# Altium schematic sheet Inertial_Measurement_RTC.SchDoc
size A3; Organization: Altium Limited; Address1: L3, 12a Rodborough Rd; Address2: Frenchs Forest; Address3: NSW; Address4: Australia 2086; DocumentNumber: 1; SheetNumber: 1; SheetTotal: 8
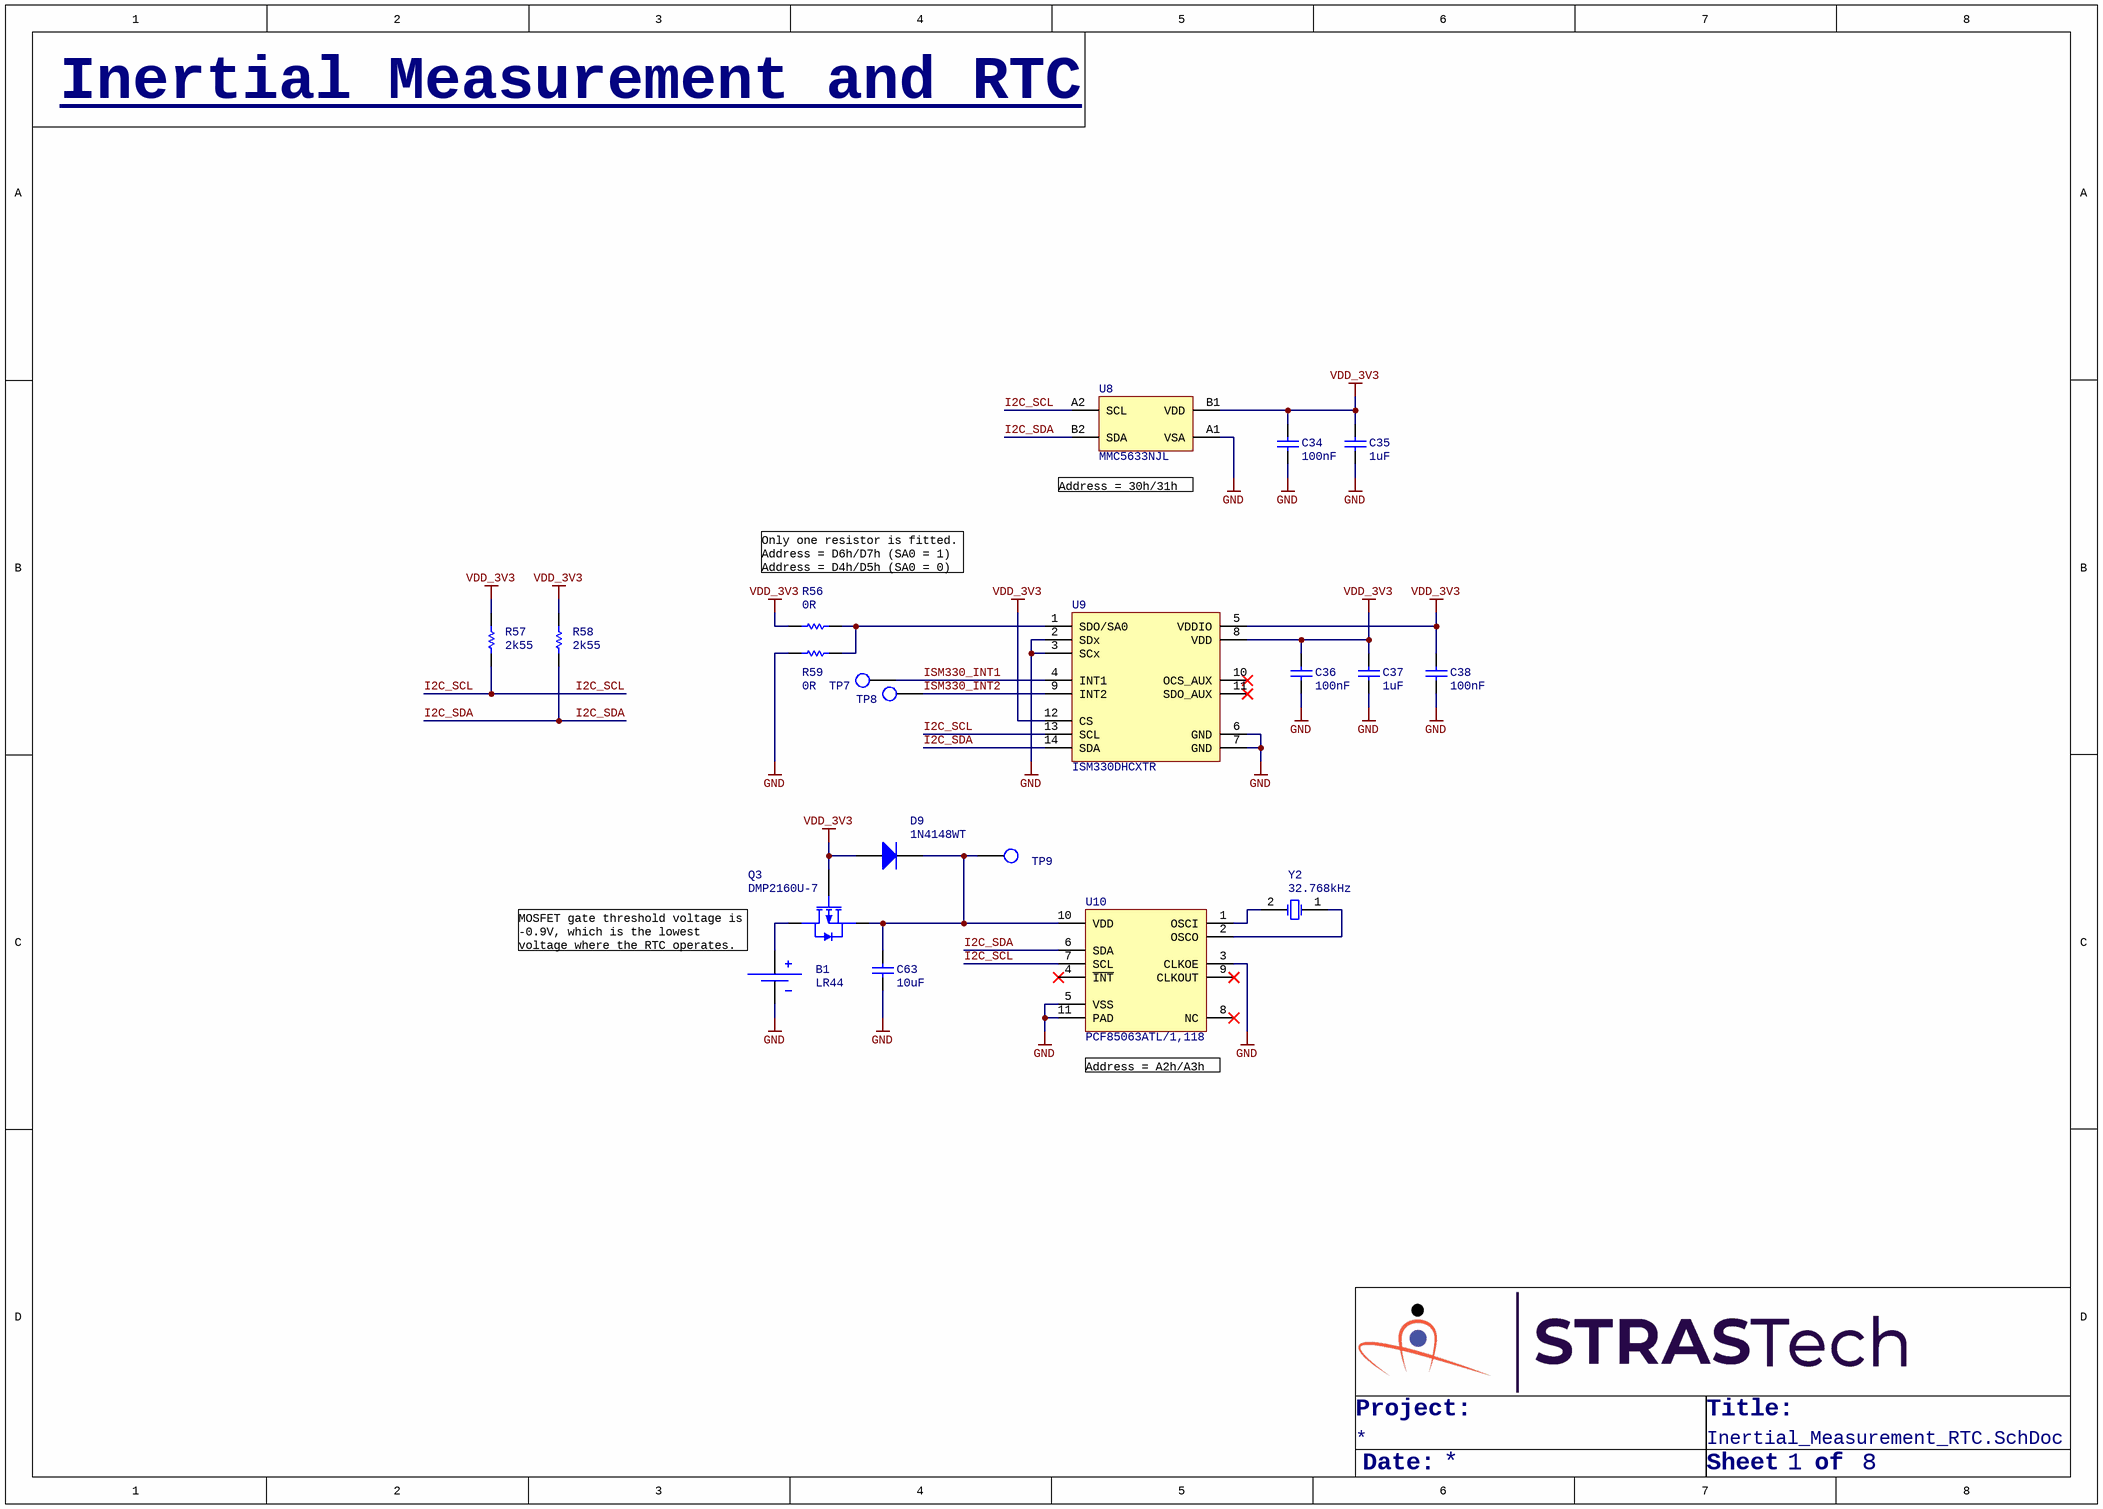
[diagram p0: Inertial_Measurement_RTC.SchDoc]

## Parts
B1  LR44  [Holder,Cell,LR44,PCB,Thru]
C34  100nF  [Cap,SMD,0402]
C35  1uF  [Cap,SMD,0402]
C36  100nF  [Cap,SMD,0402]
C37  1uF  [Cap,SMD,0402]
C38  100nF  [Cap,SMD,0402]
C63  10uF  [Cap,SMD,0402]
D9  1N4148WT  [SOD523]
Q3  DMP2160U-7  [SOT23-3]
R56  0R  [RES,0402]
R57  2k55  [RES,0402]
R58  2k55  [RES,0402]
R59  0R  [RES,0402]
TP7  TESTPOINT  [testpoint,smd,round,1mm]  (value not drawn)
TP8  TESTPOINT  [testpoint,smd,round,1mm]  (value not drawn)
TP9  TESTPOINT  [testpoint,smd,round,1mm]  (value not drawn)
U8  MMC5633NJL  [IC,WLP,2x2,P0.4mm]
U9  ISM330DHCXTR  [IC,LGA-14L,2.5x3mm]
U10  PCF85063ATL/1,118  [IC,DFN-10_3x3,P0.5mm]
Y2  32.768kHz  [XTAL,SMD,2PIN,2.0x1.2MM]

## Nets
GND: B1.2(BATT_N) C34.2 C35.1 C36.1 C37.1 C38.1 C63.2 R59.1 U8.A1(VSA) U9.2(SDx) U9.3(SCx) U9.6(GND) U9.7(GND) U10.3(CLKOE) U10.5(VSS) U10.11(PAD)
VDD_3V3: C34.1 C35.2 C36.2 C37.2 C38.2 D9.2(A) Q3.1(G) R56.1 R57.2 R58.2 U8.B1(VDD) U9.5(VDDIO) U9.8(VDD) U9.12(CS)
I2C_SCL: R57.1 U8.A2(SCL) U9.13(SCL) U10.7(SCL)
I2C_SDA: R58.1 U8.B2(SDA) U9.14(SDA) U10.6(SDA)
ISM330_INT1: TP7.1(TP) U9.4(INT1)
ISM330_INT2: TP8.1(TP) U9.9(INT2)
NetB1_1: B1.1(BATT_P) Q3.3(D)
NetC63_1: C63.1 D9.1(K) Q3.2(S) TP9.1(TP) U10.10(VDD)
NetR56_2: R56.2 R59.2 U9.1(SDO/SA0)
NetU10_1: U10.1(OSCI) Y2.2(GND)
NetU10_2: U10.2(OSCO) Y2.1(OSC1)

Not connected (* = marked no-connect by the designer): U9 10(OCS_AUX)* 11(SDO_AUX)*; U10 4(~{INT})* 8(NC)* 9(CLKOUT)*

## Notes on the sheet
- Inertial Measurement and RTC
- (near U8) Address = 30h/31h
- Only one resistor is fitted.
  Address = D6h/D7h (SA0 = 1)
  Address = D4h/D5h (SA0 = 0)
- MOSFET gate threshold voltage is -0.9V, which is the lowest voltage where the RTC operates.
- (near U10) Address = A2h/A3h
- Project:
- Title:
- Date:
- Sheet
- of
- Title
- Size:
- A3
- Revision:
- Design By:

## Library data of the parts
B1 = Holder,Cell,LR44,PCB,Thru: Battery Retainer Coin, 11.6mm 1 Cell PC Pin; Manufacturer: Keystone Electronics; Manufacturer Part Number: 2997; Vendor Part Number: 36-2997-ND; Vendor: Digikey; CreatedBy: Judd Foster; HelpURL: https://www.keyelco.com/userAssets/file/M65p7.pdf
C34 C36 C38 = CAP,Cer,100nF,25VDC,X7R,0402: 0.1µF ±10% 25V Ceramic Capacitor X7R 0402 (1005 Metric); Vendor Part Number: 490-14603-1-ND; Manufacturer: Murata Electronics; Manufacturer Part Number: GRM155R71E104KE14J; Vendor: Digikey; HelpURL: https://search.murata.co.jp/Ceramy/image/img/A01X/G101/ENG/GRM155R71E104KE14-01.pdf; CreatedBy: Judd Foster
C35 C37 = CAP,Cer,1uF,35VDC,X5R,0402: 1 µF ±10% 35V Ceramic Capacitor X5R 0402 (1005 Metric); Vendor Part Number: 445-9073-1-ND; Manufacturer: TDK Corporation; Manufacturer Part Number: C1005X5R1V105K050BC; Vendor: Digikey; HelpURL: https://product.tdk.com/info/en/catalog/datasheets/mlcc_commercial_general_en.pdf?ref_disty=digikey; CreatedBy: Judd Foster
C63 = CAP,Cer,10uF,10VDC,X5R,0402: 10 µF ±20% 10V Ceramic Capacitor X5R 0402 (1005 Metric); Vendor Part Number: 1276-1450-1-ND; Manufacturer: Samsung Electro-Mechanics; Manufacturer Part Number: CL05A106MP5NUNC; Vendor: Digikey; HelpURL: https://media.digikey.com/pdf/Data%20Sheets/Samsung%20PDFs/CL05A106MP5NUNC_Spec.pdf; CreatedBy: Judd Foster
D9 = DIODE,Gen,75V,200mA,SOD523F: Diode Standard 75 V 200mA Surface Mount SOD-523F; Manufacturer: ON Semiconductor; Vendor Part Number: 1N4148WTCT-ND; Vendor: Digikey; CreatedBy: Judd Foster; HelpURL: https://rocelec.widen.net/view/pdf/bnxdzepaue/ONSM-S-A0003584797-1.pdf?t.download=true&u=5oefqw; Manufacturer Part Number: 1N4148WT
Q3 = MOSFET,P Ch,20V,3.2A: P-Channel 20 V 3.2A (Ta) 1.4W (Ta) Surface Mount SOT-23-3; Manufacturer: Diodes Incorporated; Vendor Part Number: DMP2160UDICT-ND; Vendor: Digikey; CreatedBy: Judd Foster; HelpURL: https://media.digikey.com/pdf/Data%20Sheets/Diodes%20PDFs/DMP2160U.pdf; Manufacturer Part Number: DMP2160U-7
R56 R59 = RES,0R0,0.1W,0402: 0 Ohms Jumper 0.1W, 1/10W Chip Resistor 0402 (1005 Metric) Automotive AEC-Q200 Thick Film; Manufacturer: Panasonic Electronic Components; Manufacturer Part Number: ERJ-2GE0R00X; Vendor Part Number: P0.0JCT-ND; Vendor: Digikey; CreatedBy: Judd Foster; HelpURL: https://industrial.panasonic.com/cdbs/www-data/pdf/RDA0000/AOA0000C301.pdf
R57 R58 = RES,2k55,1%,0.063W,0402: 2.55 kOhms ±1% 0.063W, 1/16W Chip Resistor 0402 (1005 Metric) Automotive AEC-Q200 Thick Film; Manufacturer: Stackpole Electronics Inc; Manufacturer Part Number: RMCF0402FT2K55; Vendor Part Number: RMCF0402FT2K55CT-ND; Vendor: Digikey; CreatedBy: Judd Foster; HelpURL: https://www.seielect.com/catalog/sei-rmcf_rmcp.pdf
TP7-TP9 = TESTPOINT: PCB Testpoint; CreatedBy: Judd Foster; HelpURL: N/A; Manufacturer: N/A; Manufacturer Part Number: N/A; Vendor: N/A; Vendor Part Number: N/A
U8 = MMC5633NJL: Magnetoresistive Sensor X, Y, Z Axis 4-WLP (0.85x0.85); Manufacturer: Memsic Inc.; Vendor Part Number: 1267-MMC5633NJLCT-ND; Vendor: Digikey; CreatedBy: Judd Foster; HelpURL: https://media.digikey.com/pdf/Data%20Sheets/MEMSIC%20PDFs/MMC5633NJL_RevA_3-12-20.pdf; Manufacturer Part Number: MMC5633NJL
U9 = ISM330DHCXTR: Accelerometer, Gyroscope, Temperature, 6 Axis Sensor I²C, SPI Output; Manufacturer: STMicroelectronics; Vendor Part Number: 497-19784-1-ND; Vendor: Digikey; CreatedBy: Judd Foster; HelpURL: https://www.st.com/resource/en/datasheet/ism330dhcx.pdf; Manufacturer Part Number: ISM330DHCXTR
U10 = PCF85063ATL/1,118: Real Time Clock (RTC) IC Clock/Calendar - I²C, 2-Wire Serial 10-XFDFN Exposed Pad; Manufacturer: NXP USA Inc.; Vendor Part Number: 568-10235-1-ND; Vendor: Digikey; CreatedBy: Judd Foster; HelpURL: https://www.nxp.com/docs/en/data-sheet/PCF85063A.pdf; Manufacturer Part Number: PCF85063ATL/1,118
Y2 = XTAL,32.768kHz,9pF,SMD: 32.768 kHz ±20ppm Crystal 9pF 70 kOhms 2-SMD, No Lead; Manufacturer: Micro Crystal AG; Manufacturer Part Number: CM8V-T1A-32.768KHZ-9PF-20PPM-TA-QC; Vendor Part Number: 2195-CM8V-T1A-32.768KHZ-9PF-20PPM-TA-QCCT-ND; Vendor: Digikey; CreatedBy: Judd Foster; HelpURL: https://www.microcrystal.com/fileadmin/Media/Products/32kHz/Datasheet/CM8V-T1A.pdf